# EAGLE design ATtiny84LEDELSMT (EAGLE 6.3)
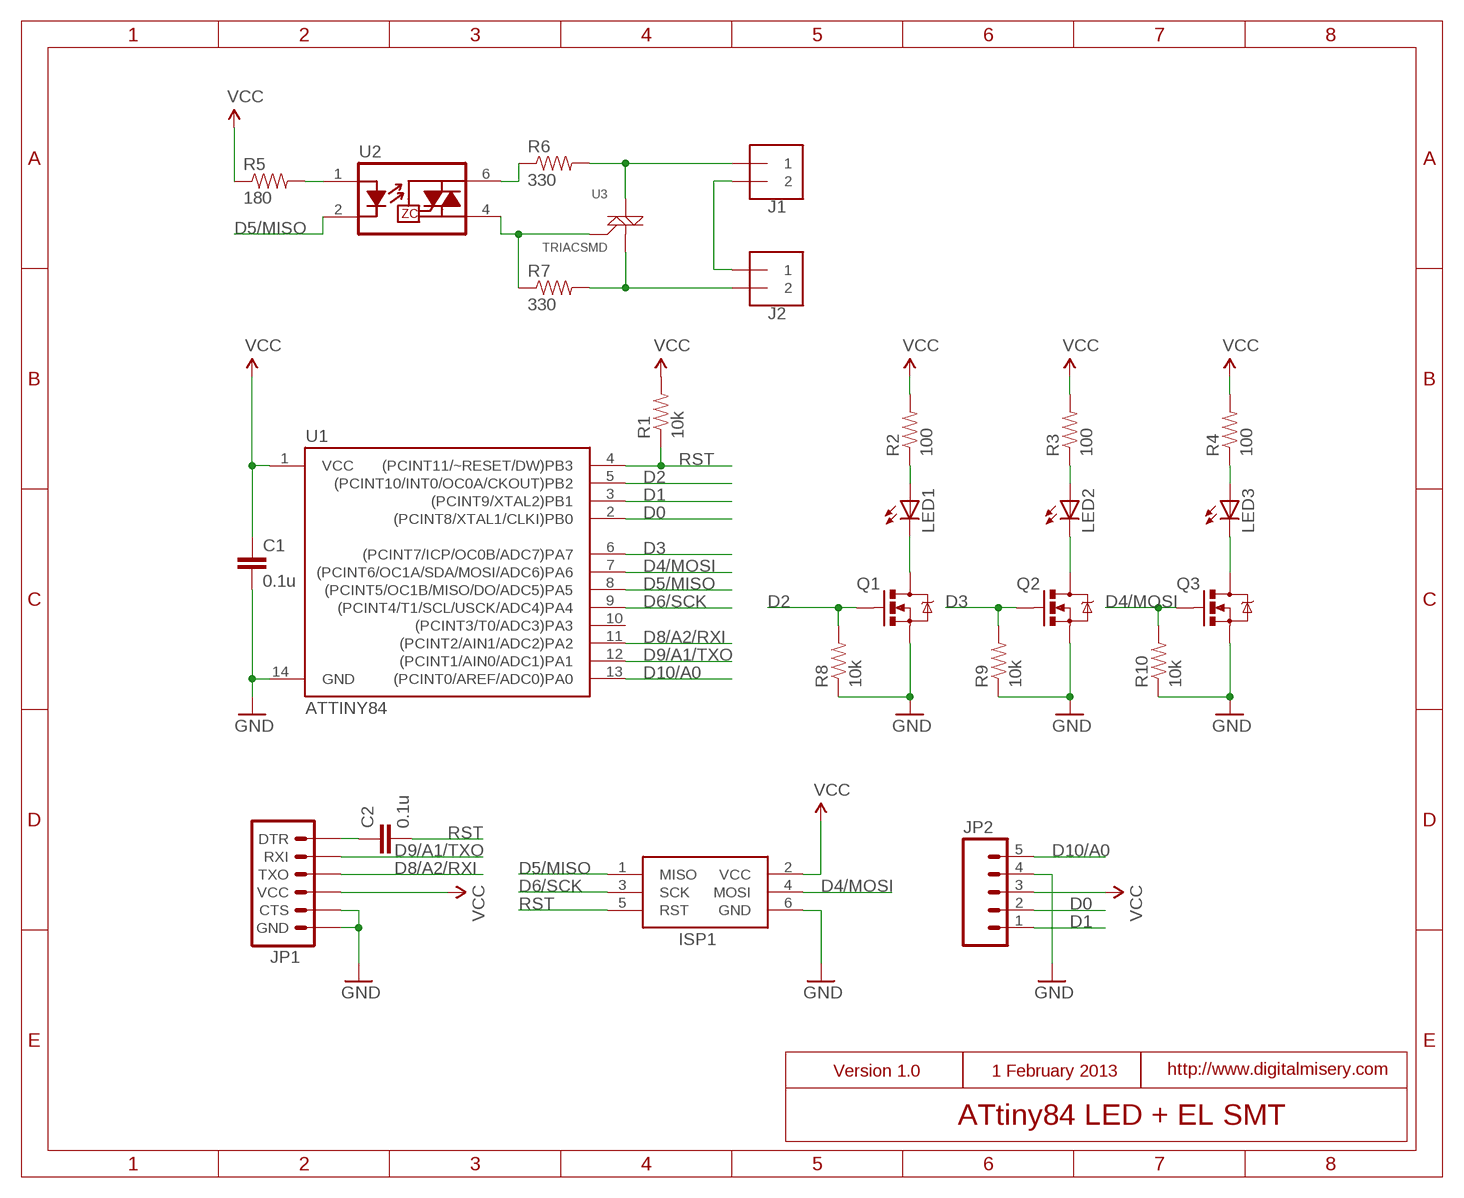
[diagram p0: schematic, sheet 1]

## Parts
C1  0.1u  CAP0805  [0805]
C2  0.1u  CAP0805  [0805]
ISP1  AVRISP-6  [AVRISP]
J1  1X2-3.5MM  [1X2-3.5MM]
J2  1X2-3.5MM  [1X2-3.5MM]
JP1  ARDUINO_SERIAL_PROGRAMPTH  [1X06]
JP2  M05PTH  [1X05]
LED1  LED5MM  [LED5MM]
LED2  LED5MM  [LED5MM]
LED3  LED5MM  [LED5MM]
Q1  MOSFET-NCHANNELBSS138  [SOT23]
Q2  MOSFET-NCHANNELBSS138  [SOT23]
Q3  MOSFET-NCHANNELBSS138  [SOT23]
R1  10k  RESISTOR0805-RES  [0805]
R2  100  RESISTOR0805-RES  [0805]
R3  100  RESISTOR0805-RES  [0805]
R4  100  RESISTOR0805-RES  [0805]
R5  180  RESISTOR0805-RES  [0805]
R6  330  RESISTOR0805-RES  [0805]
R7  330  RESISTOR0805-RES  [0805]
R8  10k  RESISTOR0805-RES  [0805]
R9  10k  RESISTOR0805-RES  [0805]
R10  10k  RESISTOR0805-RES  [0805]
U1  ATTINY84  [SO14]
U2  MOC3063S  [DIP8SMD]
U3  TRIACSMD  [SOT223]

## Nets
D0: JP2.2 U1.2((PCINT8/XTAL1/CLKI)PB0)
D1: JP2.1 U1.3((PCINT9/XTAL2)PB1)
D2: Q1.1(G) R8.2 U1.5((PCINT10/INT0/OC0A/CKOUT)PB2)
D3: Q2.1(G) R9.2 U1.6((PCINT7/ICP/OC0B/ADC7)PA7)
D4/MOSI: ISP1.4(MOSI) Q3.1(G) R10.2 U1.7((PCINT6/OC1A/SDA/MOSI/ADC6)PA6)
D5/MISO: ISP1.1(MISO) U1.8((PCINT5/OC1B/MISO/DO/ADC5)PA5) U2.2(K)
D6/SCK: ISP1.3(SCK) U1.9((PCINT4/T1/SCL/USCK/ADC4)PA4)
D8/A2/RXI: JP1.3(TXO) U1.11((PCINT2/AIN1/ADC2)PA2)
D9/A1/TXO: JP1.2(RXI) U1.12((PCINT1/AIN0/ADC1)PA1)
D10/A0: JP2.5 U1.13((PCINT0/AREF/ADC0)PA0)
GND: C1.2 ISP1.6(GND) JP1.5(CTS) JP1.6(GND) JP2.4 Q1.2(S) Q2.2(S) Q3.2(S) R8.1 R9.1 R10.1 U1.14(GND)
N$1: C2.1 JP1.1(DTR)
N$2: R5.2 U2.1(A)
N$3: LED1.K(C) Q1.3(D)
N$4: LED2.K(C) Q2.3(D)
N$5: R6.1 U2.6(T1)
N$6: LED3.K(C) Q3.3(D)
N$7: R7.1 U2.4(T2) U3.3(G)
N$8: LED1.A R2.1
N$9: J1.2 J2.1
N$12: LED2.A R3.1
N$13: J2.2 R7.2 U3.1(M1)
N$14: LED3.A R4.1
N$17: J1.1 R6.2 U3.2(M2)
RST: C2.2 ISP1.5(RST) R1.1 U1.4((PCINT11/~RESET/DW)PB3)
VCC: C1.1 ISP1.2(VCC) JP1.4(VCC) JP2.3 R1.2 R2.2 R3.2 R4.2 R5.1 U1.1(VCC)
Unconnected: U1.10((PCINT3/T0/ADC3)PA3)

## Notes on the sheet
- J1
- J2
- Version 1.0 | 1 February 2013 | http://www.digitalmisery.com
- ATtiny84 LED + EL SMT

## Library data of the parts
C1 C2 = SparkFun-Capacitors:CAP: Capacitor Standard 0603 ceramic capacitor, and 0.1" leaded capacitor.
ISP1 = adafruit:AVRISP: AVR ISP HEADER Standard 6 pin header for AVR programming
J1 J2 = adafruit:1X2: 3.5mm Terminal block http://www.ladyada.net/library/pcb/eaglelibrary.html
JP1 = SparkFun-Connectors:ARDUINO_SERIAL_PROGRAM: FTDI connector footprints
JP2 = SparkFun-Connectors:M05: Header 5 Standard 5-pin 0.1" header. Use with straight break away headers (SKU : PRT-00116), right angle break away headers (PRT-00553), swiss pins (PRT-00743), machine pins (PRT-00117), and female headers (PRT-00115). Molex polarized connector foot print use with SKU : PRT-08230 with associated crimp pins and housings.
LED1-LED3 = adafruit:LED: LED OSRAM: - CHIPLED LG R971, LG N971, LY N971, LG Q971, LY Q971, LO R971, LY R971 LH N974, LH R974 LS Q976, LO Q976, LY Q976 LO Q996 - Hyper CHIPLED LW Q18S LB Q993, LB Q99A, LB R99A - SideLED LS A670, LO A670, LY A670, LG A670, LP A670 LB A673, LV A673, LT A673, LW A673 LH A674 LY A675 LS A676, LA A676, LO A676, LY A676, LW A676 LS A679, LY A679, LG A679 - Hyper Micro SIDELED® LS Y876, LA Y876, LO Y876, LY Y876 LT Y87S - SmartLED LW L88C, LW L88S LB L89C, LB L89S, LG L890 LS L89K, LO L89K, LY L89K LS L896, LA L896, LO L896, LY L896 - TOPLED LS T670, LO T670, LY T670, LG T670, LP T670 LSG T670, LSP T670, LSY T670, LOP T670, LYG T670 LG T671, LOG T671, LSG T671 LB T673, LV T673, LT T673, LW T673 LH T674 LS T676, LA T676, LO T676, LY T676, LB T676, LH T676, LSB T676, LW T676 LB T67C, LV T67C, LT T67C, LS T67K, LO T67K, LY T67K, LW E67C LS E67B, LA E67B, LO E67B, LY E67B, LB E67C, LV E67C, LT E67C LW T67C LS T679, LY T679, LG T679 LS T770, LO T770, LY T770, LG T770, LP T770 LB T773, LV T773, LT T773, LW T773 LH T774 LS E675, LA E675, LY E675, LS T675 LS T776, LA T776, LO T776, LY T776, LB T776 LHGB T686 LT T68C, LB T68C - Hyper Mini TOPLED® LB M676 - Mini TOPLED Santana® LG M470 LS M47K, LO M47K, LY M47K Source: http://www.osram.convergy.de/
Q1-Q3 = SparkFun-DiscreteSemi:MOSFET-NCHANNEL: Common NMOSFET Parts MFG P/N Store ID Prod ID FDD8780 TRANS-09984 SI7820DN TRANS-11055 FDS6630A IC-08089 2N7002PW TRANS-11151 FQP30N06L COM-10213 TRANS-10060 BSS123LT1G TRANS-08345 BSS138 TRANS-00830 BS170 2N7000; PROD_ID: TRANS-00830
R1-R10 = SparkFun-Resistors:RESISTOR: Resistor Basic schematic elements and footprints for 0603, 1206, and PTH resistors.
U1 = SparkFun-DigitalIC:ATTINY84: Atmel 14-pin 2/4/8kB flash uC
U2 = SparkFun-DiscreteSemi:MOC3063*: Optotriac in DIP and SMD LED: Vf: 1.2V If: 5 mA TRIAC Vdrm: 600V Itsm: 1A Viso: 5000V DV/dt: 1500V/us DIP: MOC3063 SMD: MOC3063S
U3 = SparkFun-DiscreteSemi:TRIAC: Low-power generic TRIAC packages

## Board
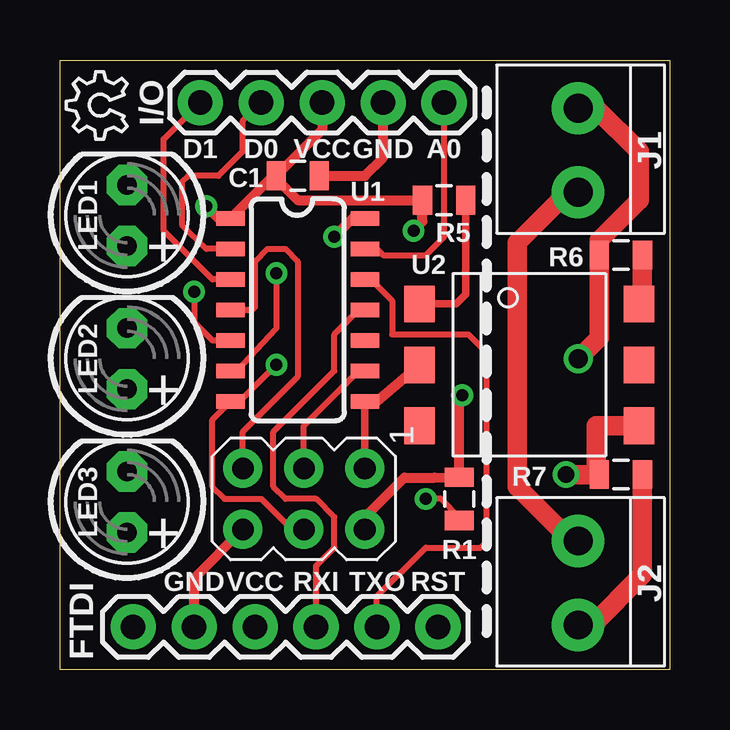
[diagram p1: board, top side]
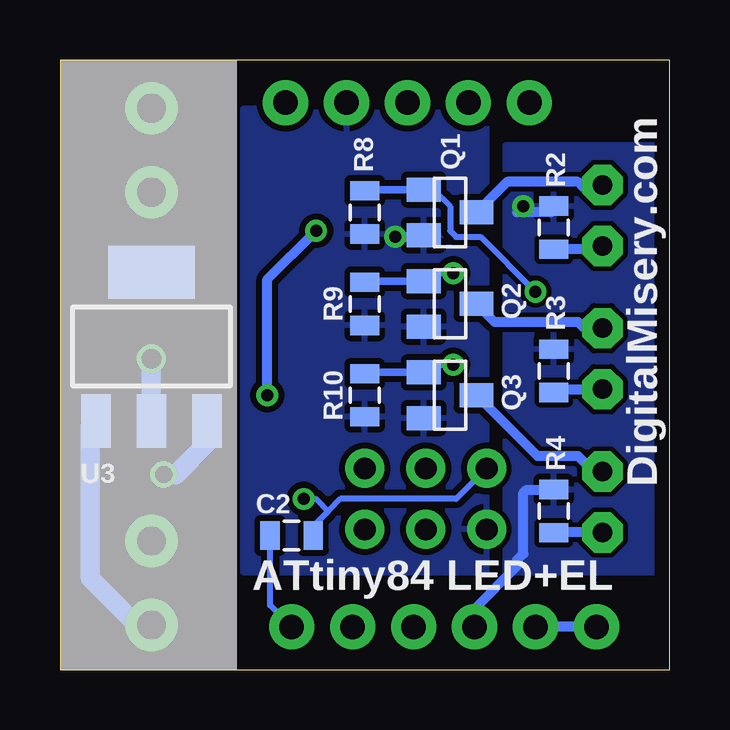
[diagram p2: board, bottom side, seen from below]

Size 25.4 x 25.4 mm. Coordinates in mm from the lower left corner, seen from the top.
Outline: 0,0 0,25.4 25.4,25.4 25.4,0 0,0
Copper layers (1*16): Top 0.035mm / dielectric 1.5mm / Bottom 0.035mm
Design rules "default *": minimum track width 10mil, minimum drill 17mil, track to track 8mil, track to pad 8mil, pad to pad 8mil, via to via 8mil, smd to smd 6mil, copper to edge 25mil, drill to drill 8mil, minimum pad ring 10mil, minimum via ring 8mil, stop-mask expansion 4mil, vias tented up to drill 25mil, thermal gap 10mil

### Footprints (pad centres in the part's own frame; a part is rotated, then mirrored left to right if it is on the bottom)
0805 = smd 0.8 x 1.2: 1 -0.9,0; 2 0.9,0
AVRISP = drill 0.9 pad 1.626: 1 -1.27,2.54; 2 1.27,2.54; 3 -1.27,0; 4 1.27,0; 5 -1.27,-2.54; 6 1.27,-2.54
1X2-3.5MM = drill 1.2 pad 2.184: 1 1.8,0; 2 -1.7,0
1X06 = drill 1.016 pad 1.88: 1 0,0; 2 2.54,0; 3 5.08,0; 4 7.62,0; 5 10.16,0; 6 12.7,0
1X05 = drill 1.016 pad 1.88: 1 0,0; 2 2.54,0; 3 5.08,0; 4 7.62,0; 5 10.16,0
LED5MM = drill 0.813 pad 1.676 octagon: A -1.27,0; K 1.27,0
SOT23 = smd 1 x 1.4: 1 -0.95,-1.1; 2 0.95,-1.1; 3 0,1.1
SO14 = smd 0.6 x 1.2: 1 -3.81,-2.8; 2 -2.54,-2.8; 3 -1.27,-2.8; 4 0,-2.8; 5 1.27,-2.8; 6 2.54,-2.8; 7 3.81,-2.8; 8 3.81,2.8; 9 2.54,2.8; 10 1.27,2.8; 11 0,2.8; 12 -1.27,2.8; 13 -2.54,2.8; 14 -3.81,2.8
DIP8SMD = smd 1.524 x 1.27: 1 -2.54,-4.572; 2 0,-4.572; 3 2.54,-4.572; 4 2.54,4.572; 5 0,4.572; 6 -2.54,4.572
SOT223 = smd 1.219 x 2.235: 1 -2.311,-3.099; 2 0,-3.099; 3 2.311,-3.099 | smd 3.6 x 2.2: 4 0,3.099

### Placement (x,y rotation side)
C1  9.91,20.57 0 top
C2  15.75,5.59 0 bottom
ISP1  10.16,7.11 270 top
J1  21.59,21.59 90 top
J2  21.59,3.56 90 top
JP1  15.75,1.78 180 top
JP2  5.84,23.62 0 top
LED1  2.79,18.92 90 top
LED2  2.79,12.95 90 top
LED3  2.79,6.99 90 top
Q1  9.14,19.05 270 bottom
Q2  9.14,15.24 270 bottom
Q3  9.14,11.43 270 bottom
R1  16.64,7.11 90 top
R2  4.83,18.41 90 bottom
R3  4.83,12.45 90 bottom
R4  4.83,6.6 90 bottom
R5  16,19.56 0 top
R6  23.37,17.27 180 top
R7  23.37,8.13 0 top
R8  12.7,19.05 90 bottom
R9  12.7,15.24 90 bottom
R10  12.7,11.43 90 bottom
U1  9.91,14.99 270 top
U2  19.56,12.7 270 top
U3  21.59,13.46 0 bottom
U$2  [OSHW_6X100_NOTEXT]  2.79,22.1 90 top

### Tracks (layer width: path | path; a pad name or v marks a point on that pad's centre or on a via)
D0
  Top 0.254: U1.2 6.1,17.53 5.08,18.54 5.08,20.32 5.33,20.57 6.6,20.57 7.62,21.59 7.62,22.86 JP2.2
D1
  Top 0.254: U1.3 6.35,16.26 4.32,18.29 4.32,22.1 JP2.1
D2  (via drill 0.5)
  Top 0.254: v5.59,15.75 5.59,14.48 6.35,13.72 U1.5
  Bottom 0.254: Q1.1 9.84,20 9.14,19.3 9.14,18.29 8.89,18.03 7.87,18.03 v5.59,15.75
  Bottom 0.305: Q1.1 12.4,20 R8.2
D3  (via drill 0.5)
  Top 0.254: U1.6 7.37,12.45 9.02,14.22 v9.02,16.51
  Bottom 0.254: Q2.1 9.67,16.51 v9.02,16.51
  Bottom 0.305: Q2.1 12.4,16.19 R9.2
D4/MOSI  (via drill 0.5)
  Top 0.254: ISP1.4 9.65,5.84 8.38,7.11 6.86,7.11 6.35,7.62 6.35,10.42 U1.7 7.49,11.18 v9.02,12.7
  Bottom 0.254: Q3.1 9.67,12.7 v9.02,12.7
  Bottom 0.305: Q3.1 12.4,12.38 R10.2
D5/MISO
  Top 0.305: ISP1.1 U1.8
  Top 0.406: U1.8 13.21,11.18 U2.2
D6/SCK
  Top 0.254: ISP1.3 10.16,10.16 12.45,12.45 U1.9
D8/A2/RXI
  Top 0.254: JP1.3 10.67,4.32 11.43,5.08 11.43,6.35 10.67,7.11 9.4,7.11 8.89,7.62 8.89,9.91 11.43,12.45 11.43,13.97 12.45,14.99 U1.11
D9/A1/TXO
  Top 0.254: JP1.2 13.21,3.05 15.24,5.08 17.53,5.08 17.78,5.33 17.78,13.21 17.02,13.97 13.84,13.97 13.84,15.37 12.95,16.26 U1.12
D10/A0
  Top 0.254: JP2.5 16,18.03 15.24,17.27 13.46,17.27 13.21,17.53 U1.13
GND  (via drill 0.5)
  Top 0.406: JP1.5 5.59,3.81 ISP1.6 | U1.14 12.19,18.8 v11.43,18.03 | C1.2 12.7,20.57 13.46,21.34 JP2.4
  Bottom 0.406: JP1.6 JP1.5 | v11.43,18.03 10.06,18.03 Q1.2
  pour Bottom (isolate 0.254): 7.62,23.37 17.78,23.37 17.78,4.06 7.62,4.06
N$1
  Bottom 0.254: JP1.1 16.65,2.68 C2.1
N$2
  Top 0.305: R5.2 16.9,15.63 16.51,15.24 U2.1
N$3
  Bottom 0.406: LED1.K 3.56,20.07 3.81,20.32 6.77,20.32 Q1.3
N$4
  Bottom 0.406: LED2.K 3.56,14.22 3.81,14.48 7.28,14.48 Q2.3
N$5
  Top 0.813: R6.1 24.27,15.36 U2.6
N$6
  Bottom 0.406: LED3.K 3.3,8.38 3.81,8.89 5.5,8.89 Q3.3
N$7  (via drill 0.7)
  Top 0.813: v21.08,8.13 R7.1 22.35,8.24 22.35,10.16 U2.4
  Bottom 0.813: v21.08,8.13 20.57,8.13 19.28,9.42 U3.3
N$8
  Bottom 0.406: 4.69,17.53 R2.1 3.06,17.52 LED1.A
N$9
  Top 0.813: J1.2 21.16,19.89 19.05,17.78 19.05,7.62 21.31,5.36 J2.1
N$12
  Bottom 0.406: R3.1 4.69,11.68 LED2.A
N$13
  Top 0.813: R7.2 24.27,3.95 22.18,1.86 J2.2
  Bottom 0.813: J2.2 22.18,1.86 24.13,3.81 24.13,10.13 U3.1
N$14
  Bottom 0.406: LED3.A 4.82,5.71 R4.1
N$17  (via drill 0.8)
  Top 0.813: J1.1 22.33,23.39 24.13,21.59 24.13,19.56 22.47,17.9 R6.2 22.47,13.83 v21.59,12.95
  Bottom 0.813: v21.59,12.95 U3.2
RST  (via drill 0.5)
  Top 0.254: U1.4 8,14.99 8.13,15.11 8.13,17.02 8.64,17.53 9.4,17.53 9.91,17.02 9.91,12.19 7.62,9.91 ISP1.5 | v15.24,7.11 15.88,7.11 16.64,6.35 R1.1
  Bottom 0.254: ISP1.5 8.89,7.11 13.72,7.11 14.22,6.6 | 14.22,6.6 14.85,5.98 C2.2 | v15.24,7.11 14.73,7.11 14.22,6.6
VCC  (via drill 0.5)
  Top 0.406: C1.1 8.88,20.57 U1.1 6.6,18.8 v6.1,19.3 | C1.1 9.01,20.46 9.91,19.56 R5.1 15.1,18.68 v14.73,18.29 | ISP1.2 12.7,6.35 14.35,8 15.61,8 R1.2 16.64,11.3 v16.76,11.43 | JP2.3 10.92,22.49 C1.1
  Bottom 0.406: R2.2 4.96,19.05 6.35,19.05 | v16.76,11.43 16.76,16.26 v14.73,18.29 | JP1.4 8.13,2.54 6.35,4.32 6.35,4.57 6.1,4.83 6.1,7.37 5.97,7.49 R4.2
  pour Bottom: 0,21.84 6.86,21.84 6.86,4.06 0,4.06

### Text on the board
tPlace: I/O | D1 | D0 | VCC | GND | A0 | LED1 | + | LED2 | + | LED3 | + | GND | VCC | RXI | TXO | RST | FTDI
bPlace: DigitalMisery.com | ATtiny84 LED+EL